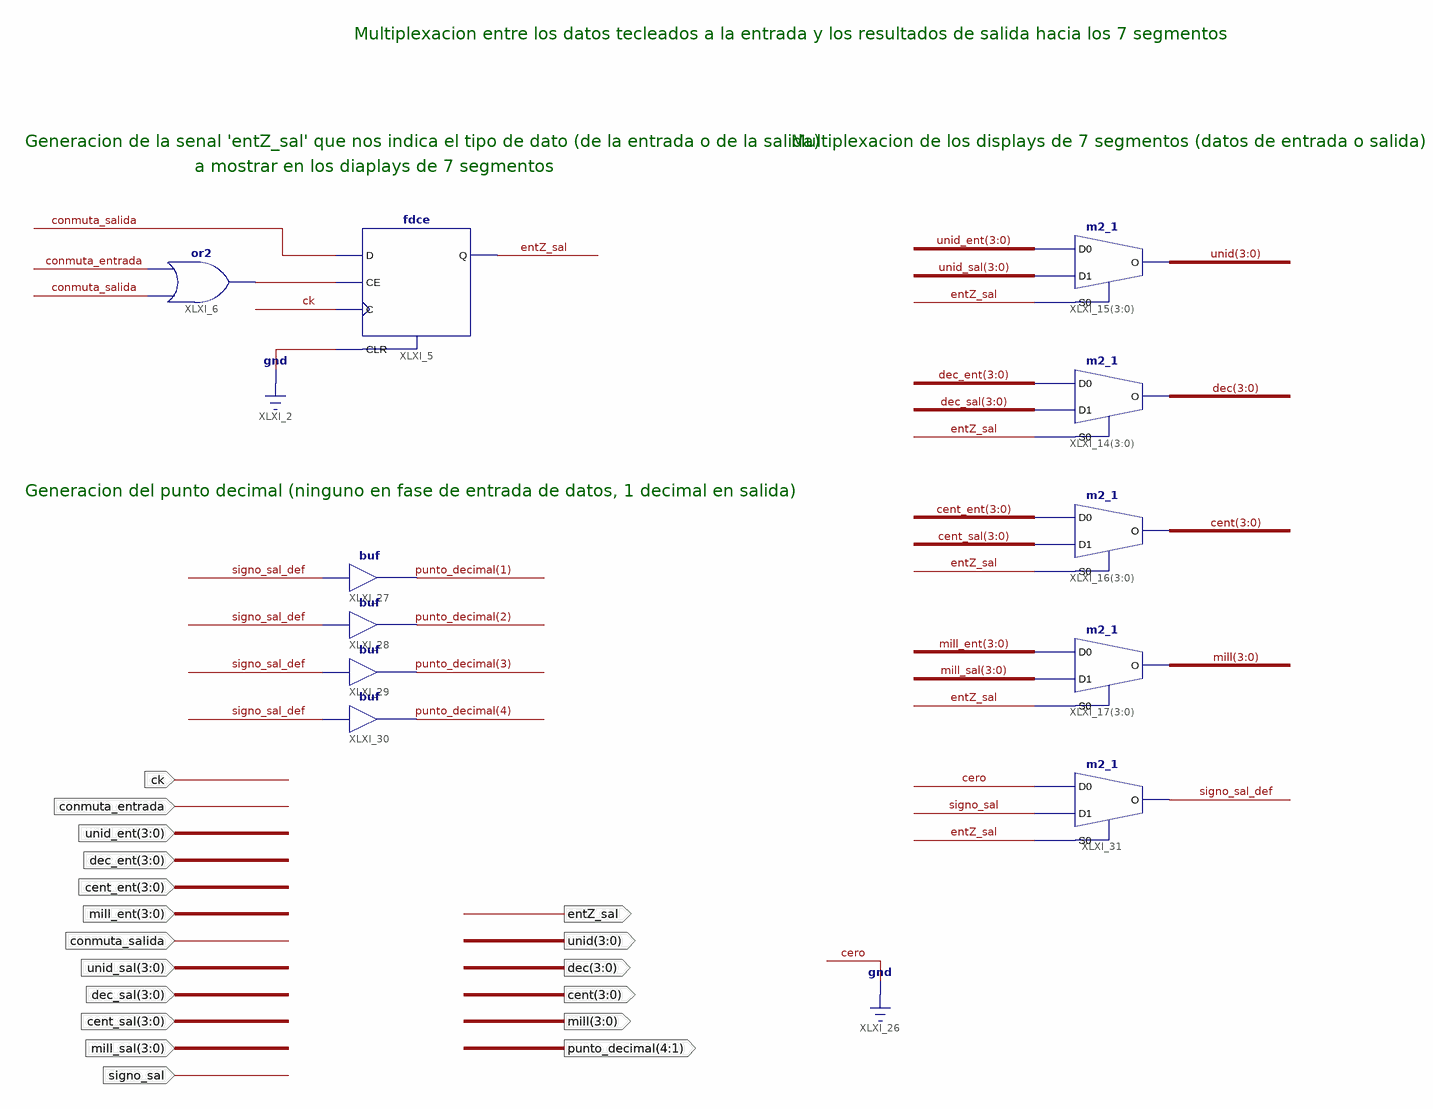
[diagram p0: schematic sheet 1]
// Xilinx ISE schematic Mux_Ent_Sal_7seg_4cifras.sch (spartan6) as structural Verilog: 11 symbols, 18 ports
module Mux_Ent_Sal_7seg_4cifras (
  input  conmuta_salida,
  input  [3:0] cent_ent,
  input  [3:0] dec_ent,
  input  conmuta_entrada,
  input  ck,
  input  [3:0] unid_ent,
  input  [3:0] mill_ent,
  input  [3:0] unid_sal,
  input  [3:0] dec_sal,
  input  [3:0] cent_sal,
  input  [3:0] mill_sal,
  input  signo_sal,
  output [4:1] punto_decimal,
  output entZ_sal,
  output [3:0] unid,
  output [3:0] dec,
  output [3:0] cent,
  output [3:0] mill
);

  wire signo_sal_def, XLXN_132;

  fdce XLXI_5 (.C(ck), .CE(XLXN_132), .CLR(1'b0), .D(conmuta_salida), .Q(entZ_sal));
  or XLXI_6 (XLXN_132, conmuta_salida, conmuta_entrada);
  buf XLXI_27 (punto_decimal[1], signo_sal_def);
  buf XLXI_28 (punto_decimal[2], signo_sal_def);
  buf XLXI_29 (punto_decimal[3], signo_sal_def);
  buf XLXI_30 (punto_decimal[4], signo_sal_def);
  m2_1 XLXI_16[3:0] (.D0(cent_ent), .D1(cent_sal), .S0(entZ_sal), .O(cent));
  m2_1 XLXI_17[3:0] (.D0(mill_ent), .D1(mill_sal), .S0(entZ_sal), .O(mill));
  m2_1 XLXI_14[3:0] (.D0(dec_ent), .D1(dec_sal), .S0(entZ_sal), .O(dec));
  m2_1 XLXI_15[3:0] (.D0(unid_ent), .D1(unid_sal), .S0(entZ_sal), .O(unid));
  m2_1 XLXI_31 (.D0(1'b0), .D1(signo_sal), .S0(entZ_sal), .O(signo_sal_def));

  // Notes on the sheet:
  //   Multiplexacion entre los datos tecleados a la entrada y los resultados de salida hacia los 7 segmentos
  //   Generacion de la senal 'entZ_sal' que nos indica el tipo de dato (de la entrada o de la salida)
  //   Multiplexacion de los displays de 7 segmentos (datos de entrada o salida)
  //   a mostrar en los diaplays de 7 segmentos
  //   Generacion del punto decimal (ninguno en fase de entrada de datos, 1 decimal en salida)
endmodule
